# Altium schematic sheet Power_onboard.SchDoc
size A
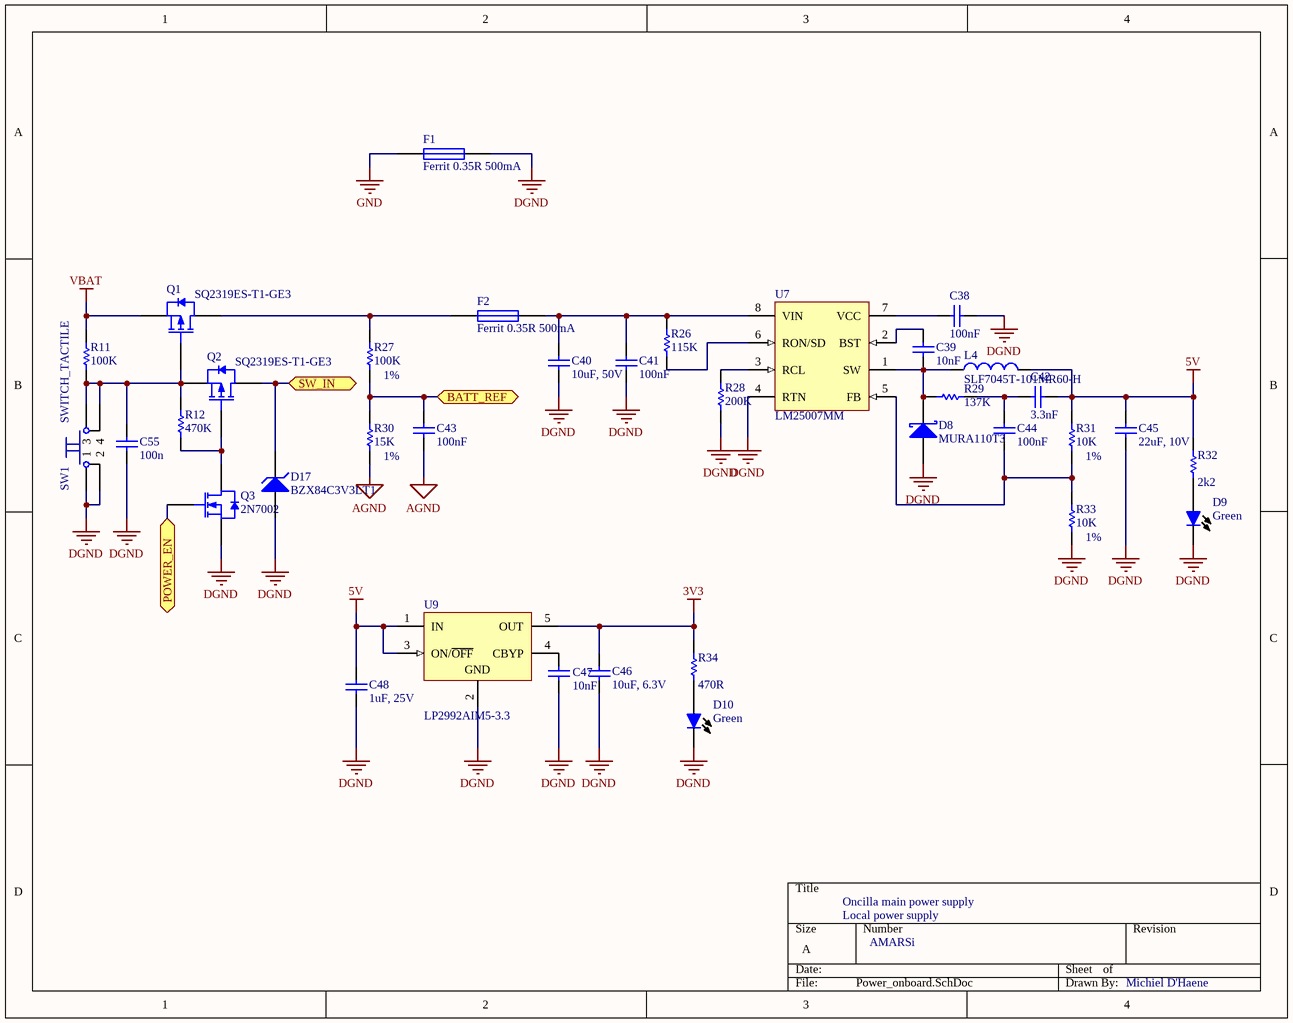
[diagram p0: Power_onboard.SchDoc]

## Parts
C38  100nF  [CAPC1608L]
C39  10nF  [CAPC1608L]
C40  10uF, 50V  [CAPC3216L]
C41  100nF  [CAPC1608L]
C42  3.3nF  [CAPC1608L]
C43  100nF  [CAPC1608L]
C44  value 100nF  [CAPC1608L]  (hidden comment: 22nF)
C45  22uF, 10V  [CAPC3216L]
C46  10uF, 6.3V  [CAPC1608L]
C47  10nF  [CAPC1608L]
C48  1uF, 25V  [CAPC1608L]
C55  100n  [CAPC1608L]
D8  MURA110T3  [SMA]
D9  Color: Green  [CD1608-0603]  (hidden comment: LED Green)
D10  Color: Green  [CD1608-0603]  (hidden comment: LED Green)
D17  BZX84C3V3LT1  [318-07]
F1  Ferrit 0.35R 500mA  [RESC1608L]
F2  Ferrit 0.35R 500mA  [RESC1608L]
L4  SLF7045T-101MR60-H  [SLF7045T]
Q1  SQ2319ES-T1-GE3  [SOT23_N]
Q2  SQ2319ES-T1-GE3  [SOT23_N]
Q3  2N7002  [SOT23_N]
R11  100k  [RESC1608L]
R12  value 470K  [RESC1608L]  (hidden comment: 100k)
R26  115k  [RESC1608L]
R27  value 100K  Precision: 1%  [RESC1608L]  (hidden comment: 100k, 1%)
R28  200k  [RESC1608L]
R29  value 137K  [RESC1608L]  (hidden comment: 138k)
R30  value 15K  Precision: 1%  [RESC1608L]  (hidden comment: 15k, 1%)
R31  value 10K  Precision: 1%  [RESC1608L]  (hidden comment: 10k, 1%)
R32  2k2  [RESC1608L]
R33  value 10K  Precision: 1%  [RESC1608L]  (hidden comment: 10k, 1%)
R34  470R  [RESC1608L]
SW1  SWITCH_TACTILE  [TACTILE_SWITCH]
U7  LM25007MM  [MUA08A_N]
U9  LP2992AIM5-3.3  [MF05A_N]

## Ports
BATT_REF, POWER_EN, SW_IN

## Nets
3V3: C46.2 R34.2 U9.5(OUT)
5V: C42.2 C45.2 C48.2 L4.2 R31.2 R32.2 U9.1(IN) U9.3(ON/~{OFF})
AGND: C43.1 R30.1
DGND: C38.1 C40.1 C41.1 C45.1 C46.1 C47.1 C48.1 C55.1 D8.1(A) D9.2(C) D10.2(C) D17.1(A) F1.2 Q3.2(S) R28.1 R33.1 SW1.1 SW1.2 U7.4(RTN) U9.2(GND)
GND: F1.1
VBAT: Q1.2(S) R11.2
BATT_REF: C43.2 R27.1 R30.2 ; port BATT_REF
POWER_EN: Q3.1(G) ; port POWER_EN
SW_IN: D17.3(K) Q2.3(D) ; port SW_IN
NetC38_2: C38.2 U7.7(VCC)
NetC39_1: C39.1 D8.2(K) L4.1 R29.2 U7.1(SW)
NetC39_2: C39.2 U7.2(BST)
NetC40_2: C40.2 C41.2 F2.2 R26.2 U7.8(VIN)
NetC42_1: C42.1 C44.2 R29.1
NetC44_1: C44.1 R31.1 R33.2 U7.5(FB)
NetC47_2: C47.2 U9.4(CBYP)
NetC55_2: C55.2 Q1.1(G) Q2.2(S) R11.1 R12.2 SW1.3 SW1.4
NetD9_1: D9.1(A) R32.1
NetD10_1: D10.1(A) R34.1
NetF2_1: F2.1 Q1.3(D) R27.2
NetQ2_1: Q2.1(G) Q3.3(D) R12.1
NetR26_1: R26.1 U7.6(RON/SD)
NetR28_2: R28.2 U7.3(RCL)

## Notes on the sheet
- Oncilla main power supply
- Local power supply
- AMARSi
- Michiel D'Haene

## Library data of the parts
C38-C48 C55 = Cap Semi: Capacitor (Semiconductor SIM Model); Published: 8-Jun-2000; LatestRevisionDate: 29-May-2009; LatestRevisionNote: IPC-7351 Footprint Added.; PackageReference: C1206; Publisher: Altium Limited; PackageDescription: Chip Capacitor
  C38 C41 C43: Value: 100nF
  C39 C47: Value: 10nF
  C40: Value: 10uF, 50V
  C42: Value: 3.3nF
  C45: Value: 22uF, 10V
  C46: Value: 10uF, 6.3V
  C48: Value: 1uF, 25V
  C55: Value: 100n
D8 = 10MQ060N: Schottky Rectifier; PackageDocument: revH, May-2002; Published: 17-Sep-2003; DatasheetDocument: May-2002; PackageReference: SMA; Publisher: Altium Limited; ComponentLink1Description: Manufacturer Link; ComponentLink1URL: http://www.irf.com/; ComponentLink2Description: Datasheet; ComponentLink2URL: http://www.irf.com/product-info/datasheets/data/10MQ060N.pdf
D9 D10 = LED
D17 = BZX84C3V3LT1: Zener Voltage Regulator Diode; Note: Pin 2 is not connected and not drawn.; Published: 29-Sep-2000; LatestRevisionDate: 17-Jul-2002; LatestRevisionNote: Re-released for DXP Platform.; PackageReference: 318-07; Publisher: Altium Limited; PackageDescription: SOT-23; 3 Leads; Body 3.0 x 2.5 mm, inc. leads (LxW max); ComponentLink1Description: Manufacturer Link; ComponentLink1URL: http://www.onsemi.com/site/products/landing?taxonomyID=194; ComponentLink2Description: Datasheet; ComponentLink2URL: http://www.onsemi.com/pub/Collateral/BZX84C2V4LT1-D.PDF
F1 F2 = Fuse 1: Ferrit Bead; Published: 8-Jun-2000; LatestRevisionDate: 17-Jul-2002; LatestRevisionNote: Re-released for DXP Platform.; PackageReference: PIN-W2/E2.8; Publisher: Altium Limited
L4 = Inductor
Q1 Q2 = BSS84: P-channel Enhancement Mode Vertical D-MOSFET; Published: 17-Sep-2003; LatestRevisionDate: 12-Dec-2006; LatestRevisionNote: IPC-7351 Footprint Added.; DatasheetVersion: 18-Jun-1997; PackageVersion: May-1999; PackageReference: SOT23; Publisher: Altium Limited; PackageDescription: 3-Pin SOT-23 Package 0.95 mm Pitch, 2.3 mm Lead Span; ComponentLink1Description: Manufacturer Link; ComponentLink1URL: http://www.semiconductors.philips.com/; ComponentLink2Description: Datasheet; ComponentLink2URL: http://www.semiconductors.philips.com/acrobat/datasheets/BSS84_3.pdf
Q3 = BST82: N-channel Enhancement Mode Field-effect Transistor; Published: 17-Sep-2003; LatestRevisionDate: 12-Dec-2006; LatestRevisionNote: IPC-7351 Footprint Added.; DatasheetVersion: 26-Jul-2000; PackageVersion: May-1999; PackageReference: SOT23; Publisher: Altium Limited; PackageDescription: 3-Pin SOT-23 Package 0.95 mm Pitch, 2.3 mm Lead Span; ComponentLink1Description: Manufacturer Link; ComponentLink1URL: http://www.semiconductors.philips.com/; ComponentLink2Description: Datasheet; ComponentLink2URL: http://www.semiconductors.philips.com/acrobat/datasheets/BST82-03.pdf
R11 R12 R26-R34 = Res Semi: Semiconductor Resistor; Published: 8-Jun-2000; LatestRevisionDate: 17-Jul-2002; LatestRevisionNote: Re-released for DXP Platform.; PackageReference: AXIAL-0.5; Publisher: Altium Limited
  R11: Value: 100K
  R26: Value: 115K
  R28: Value: 200K
  R32: Value: 2k2
  R34: Value: 470R
U7 = LM25007MM: 42V, 0.5A Step-Down Switching Regulator; Manufacturer: National Semiconductor; CompType: MiscPower; PackageTopMarking: ZXTT*SLYB; PowerWise: N; FirstPublished: 4-Dec-2008; DatasheetVersion: Feb-2008; PackageVersion: revF, Apr-2008; PackageReference: MUA08A; Publisher: Altium Limited; PackageDescription: MINI SOIC, .118 x .118 x .034in, 8 Lead, .0256in Pitch; PartNumber: LM25007MM; RoHS: Y; PinCount: 8; DigiKeyPartNumber: LM25007MMCT-ND; Code_JEDEC: MO-187-AA; ComponentLink1Description: LM25007 Datasheet; ComponentLink1URL: http://www.national.com/ds/LM/LM25007.pdf; ComponentLink2Description: LM25007 Web Page; ComponentLink2URL: http://www.national.com/pf/LM/LM25007.html; ComponentLink3Description: MUA08A Package Page; ComponentLink3URL: http://www.national.com/packaging/folders/mua08a.html
U9 = LP2992AIM5-5.0: Micropower 250 mA Low-Noise Ultra Low-Dropout Regulator in SOT-23 and LLP Packages; Manufacturer: National Semiconductor; CompType: LDO IC; PackageTopMarking: LFFA*XTT; PowerWise: N; Published: 4-Dec-2008; DatasheetVersion: May-2005; PackageVersion: revD, Aug-2008; PackageReference: MF05A; Publisher: Altium Limited; PackageDescription: Molded SOT-23, .115 x .063 x .040 in Body, 5 Lead, .0375 in Pitch; PartNumber: LP2992AIM5-5.0; RoHS: O; PinCount: 5; DigiKeyPartNumber: LP2992AIM5-5.0CT-ND; ComponentLink1Description: LP2992 Datasheet; ComponentLink1URL: http://www.national.com/ds/LP/LP2992.pdf; ComponentLink2Description: LP2992 Web Page; ComponentLink2URL: http://www.national.com/pf/LP/LP2992.html; ComponentLink3Description: MF05A Package Page; ComponentLink3URL: http://www.national.com/packaging/folders/mf05a.html